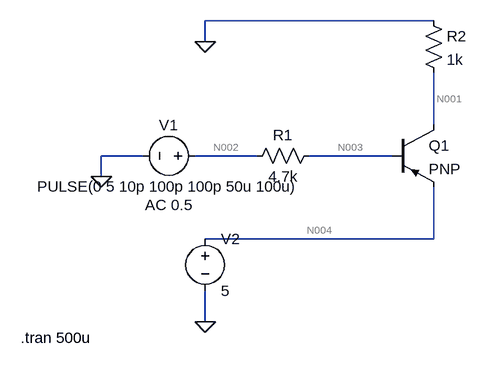
[diagram p0: schematic Simulationtest.asc]
Simulationtest.asc, the LTspice schematic file:
Version 4
SHEET 1 880 680
WIRE 304 -48 -48 -48
WIRE -48 -16 -48 -48
WIRE 304 112 304 32
WIRE -144 160 -208 160
WIRE 32 160 -64 160
WIRE 240 160 112 160
WIRE -208 192 -208 160
WIRE 304 288 304 208
WIRE 304 288 -48 288
WIRE -48 416 -48 368
FLAG -48 -16 0
FLAG -208 192 0
FLAG -48 416 0
SYMBOL res 128 144 R90
WINDOW 0 0 56 VBottom 2
WINDOW 3 32 56 VTop 2
SYMATTR InstName R1
SYMATTR Value 4.7k
SYMBOL pnp 240 112 R0
SYMATTR InstName Q1
SYMBOL res 288 -64 R0
SYMATTR InstName R2
SYMATTR Value 1k
SYMBOL voltage -48 160 R90
WINDOW 0 -32 56 VBottom 2
WINDOW 3 32 56 VTop 2
WINDOW 123 60 56 VTop 2
WINDOW 39 0 0 Left 0
SYMATTR InstName V1
SYMATTR Value PULSE(0 5 10p 100p 100p 50u 100u)
SYMATTR Value2 AC 0.5
SYMBOL voltage -48 272 R0
WINDOW 123 0 0 Left 0
WINDOW 39 0 0 Left 0
SYMATTR InstName V2
SYMATTR Value 5
TEXT -332 440 Left 2 !.tran 500u

The netlist it stands for:
* Simulationtest.asc
R1 N003 N002 4.7k
Q1 N001 N003 N004 0 PNP
R2 0 N001 1k
V1 N002 0 PULSE(0 5 10p 100p 100p 50u 100u) AC 0.5
V2 N004 0 5
.model NPN NPN
.model PNP PNP
.lib standard.bjt
.tran 500u
.backanno
.end

* Results of the author's LTspice run, read from the files saved beside the schematic
* Operating Point, zero values left out:
*   V(n003) = 4.176 V
*   V(n002) = -620 mV
*   V(n001) = 4.949 V
*   V(n004) = 5 V
*   Ic(Q1) = -4.949 mA
*   Ib(Q1) = -1.02 mA
*   Ie(Q1) = 5.969 mA
*   I(R2) = -4.949 mA
*   I(R1) = 1.02 mA
*   I(V2) = -5.969 mA
*   I(V1) = 1.02 mA